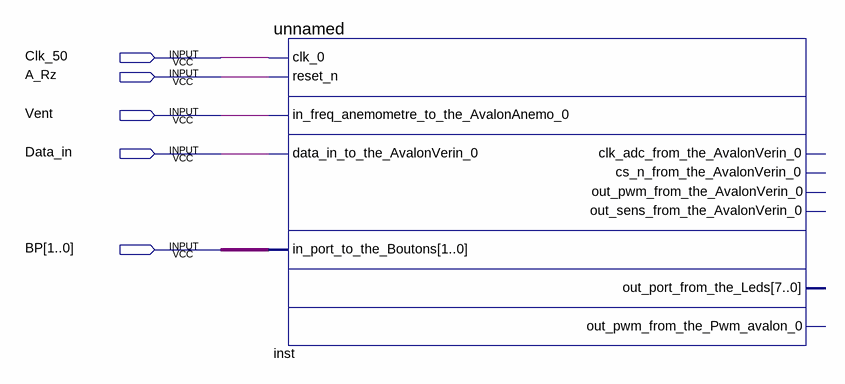
[diagram p0: schematic sheet]
// Quartus schematic Barre_Franche.bdf as structural Verilog: 1 symbols, 5 pins
module Barre_Franche (
  input  Clk_50,
  input  A_Rz,
  input  Vent,
  input  Data_in,
  input  [1:0] BP
);

  unnamed inst (
    .clk_0(Clk_50), .reset_n(A_Rz), .in_freq_anemometre_to_the_AvalonAnemo_0(Vent),
    .data_in_to_the_AvalonVerin_0(Data_in), .in_port_to_the_Boutons(BP));  // open: clk_adc_from_the_AvalonVerin_0, cs_n_from_the_AvalonVerin_0, out_pwm_from_the_AvalonVerin_0, out_sens_from_the_AvalonVerin_0, out_port_from_the_Leds, out_pwm_from_the_Pwm_avalon_0
endmodule
